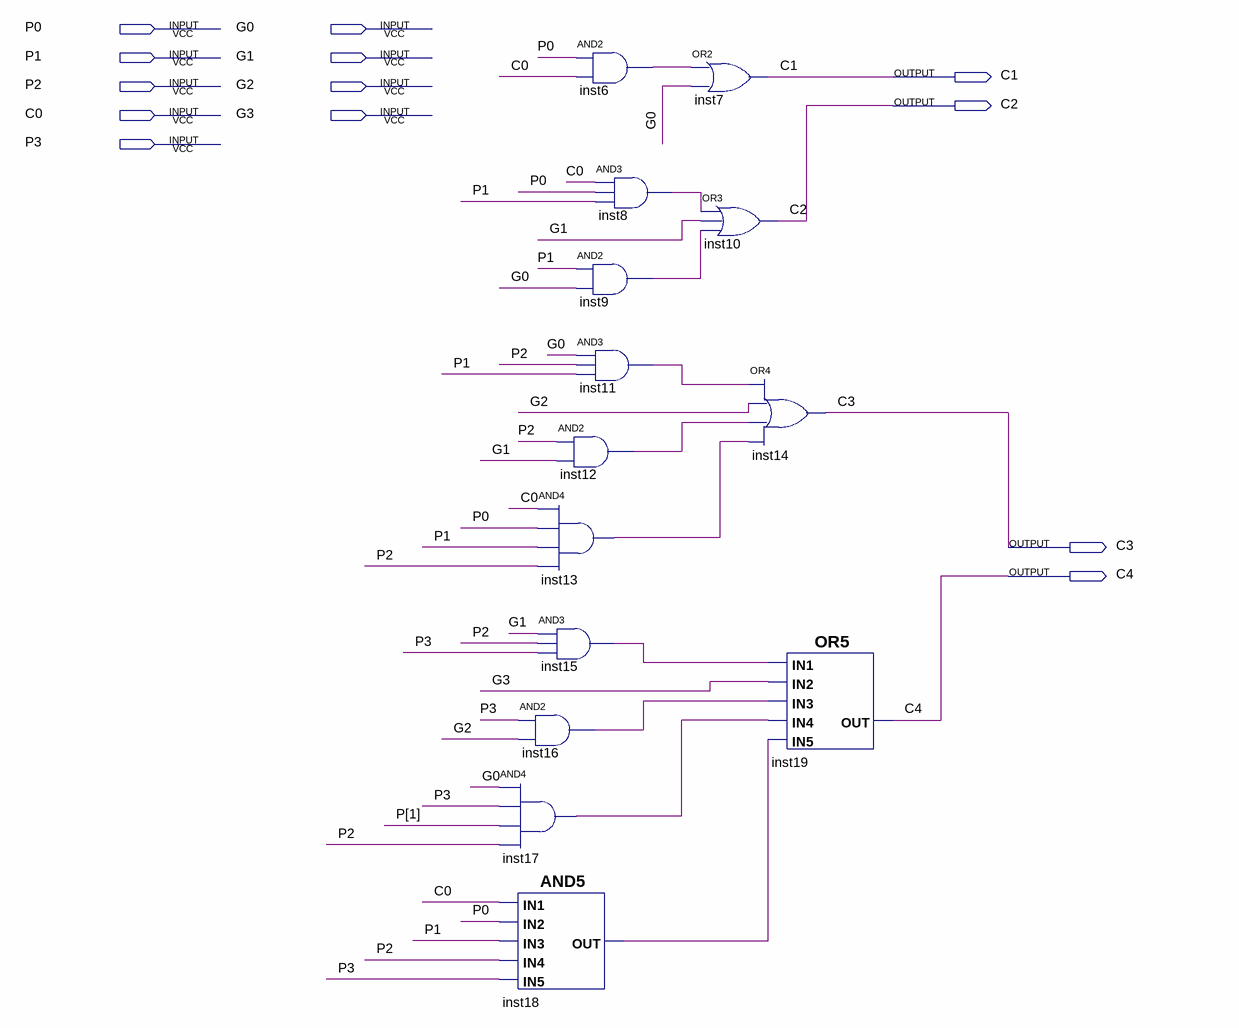
[diagram p0: schematic sheet]
// Quartus schematic CLG4.bdf as structural Verilog: 14 symbols, 13 pins
module CLG4 (
  input  P0,
  input  G0,
  input  P1,
  input  G1,
  input  P2,
  input  G2,
  input  C0,
  input  G3,
  input  P3,
  output C1,
  output C2,
  output C3,
  output C4
);

  wire inst6_out, inst8_out, inst9_out, inst11_out, inst12_out, inst13_out, inst15_out, inst16_out,
       inst17_out, inst18_out;

  and inst13 (inst13_out, C0, P0, P1, P2);
  and inst15 (inst15_out, G1, P2, P3);
  and inst16 (inst16_out, P3, G2);
  and inst17 (inst17_out, G0, P3, P1, P2);
  and inst18 (inst18_out, C0, P0, P1, P2, P3);
  and inst6 (inst6_out, P0, C0);
  and inst8 (inst8_out, C0, P0, P1);
  and inst9 (inst9_out, P1, G0);
  and inst11 (inst11_out, G0, P2, P1);
  and inst12 (inst12_out, P2, G1);
  or inst7 (C1, inst6_out, G0);
  or inst10 (C2, inst8_out, G1, inst9_out);
  or inst14 (C3, inst11_out, G2, inst12_out, inst13_out);
  or inst19 (C4, inst15_out, G3, inst16_out, inst17_out, inst18_out);
endmodule
